# Altium schematic sheet PIC32MK.SchDoc
size B; DocumentNumber: 3; SheetNumber: 2; SheetTotal: 4
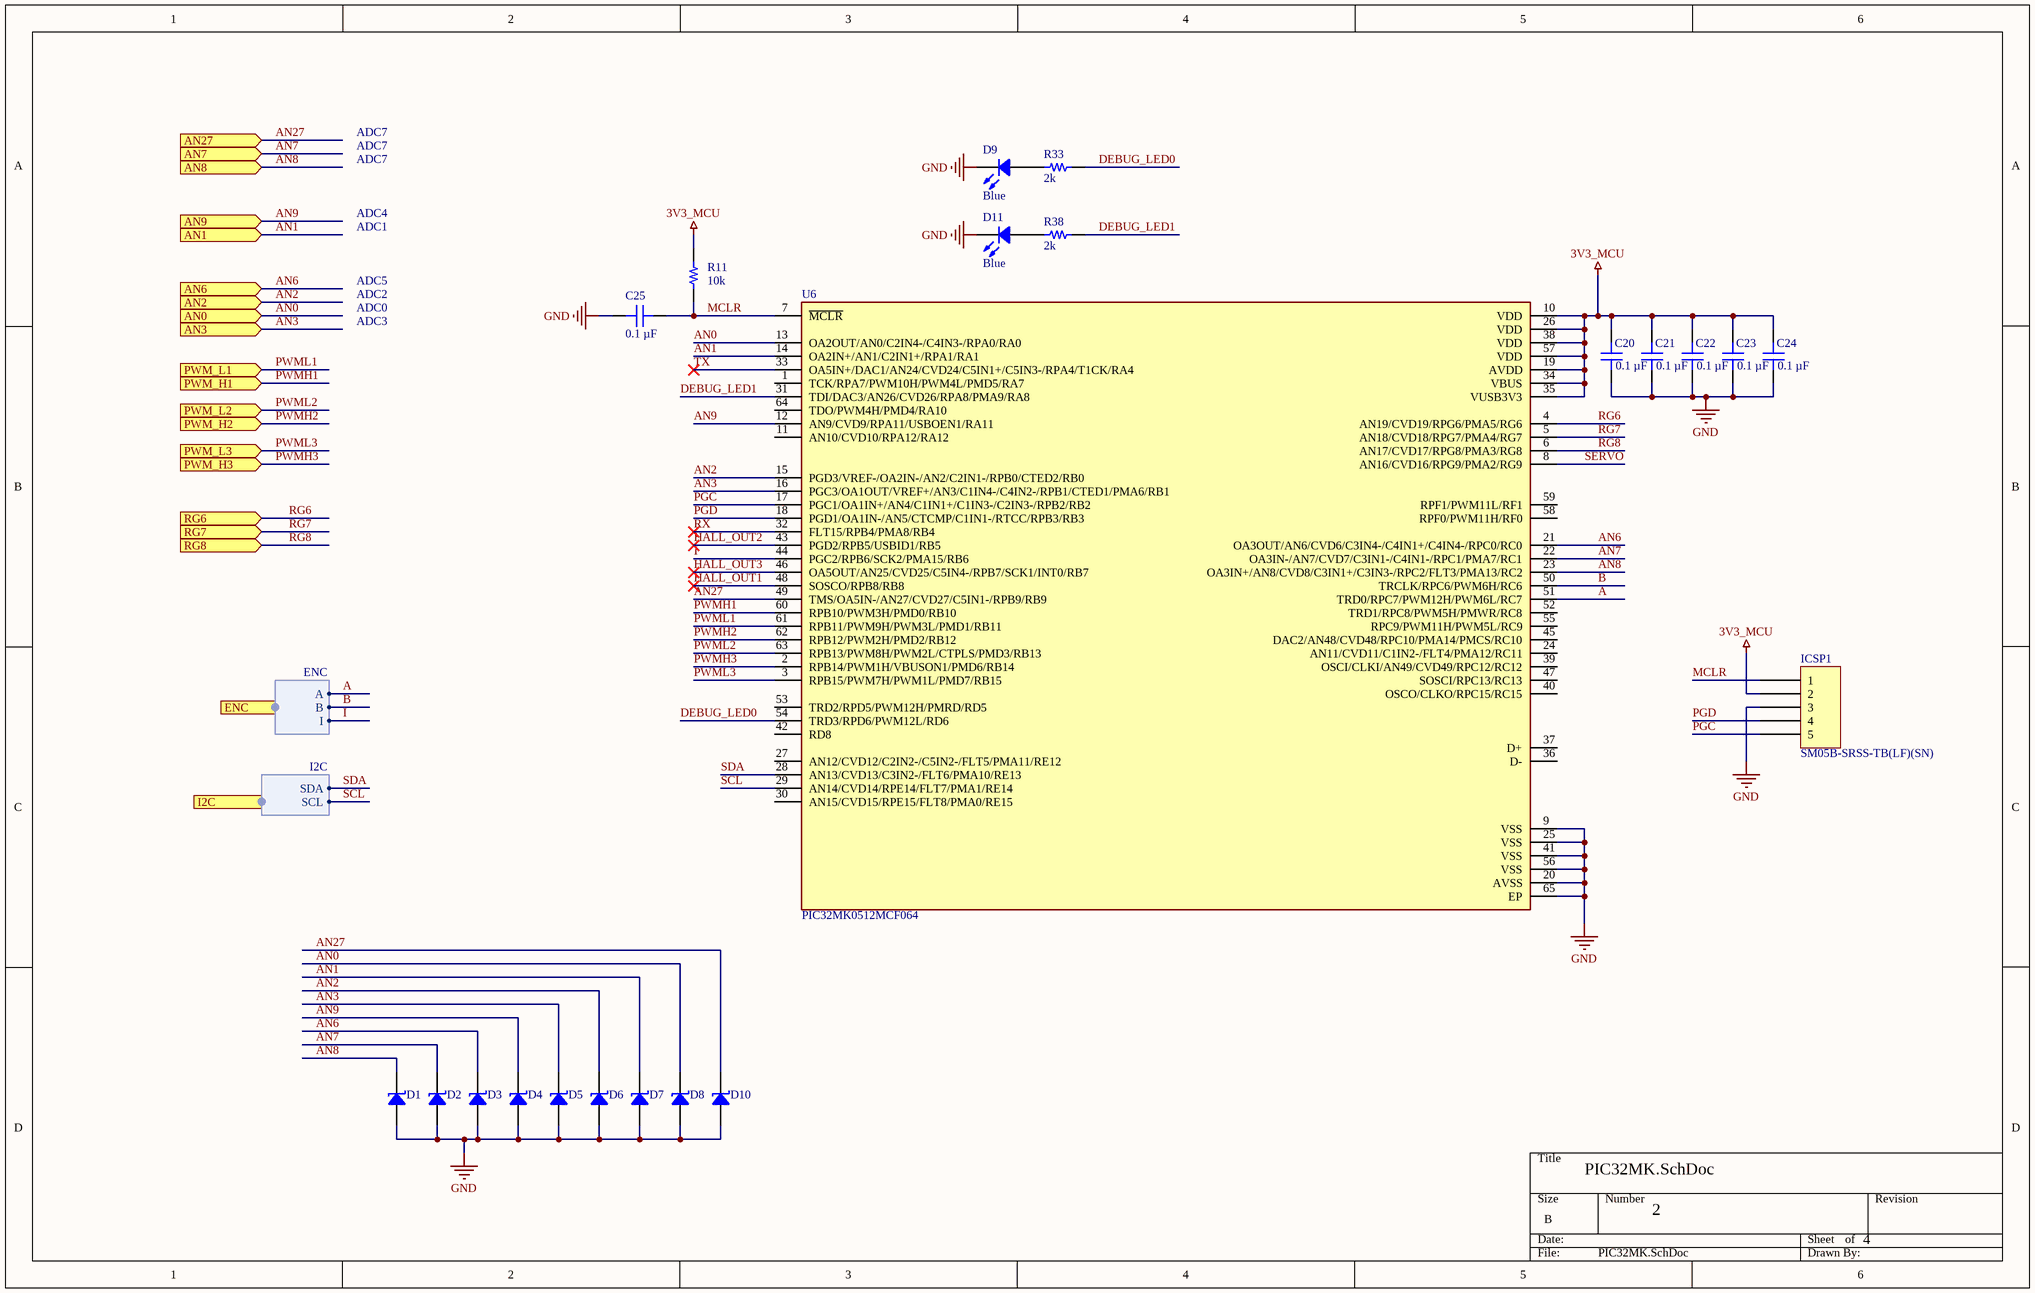
[diagram p0: PIC32MK.SchDoc]

## Parts
C20  0.1 µF  [CAP 0402_1005]
C21  0.1 µF  [CAP 0402_1005]
C22  0.1 µF  [CAP 0402_1005]
C23  0.1 µF  [CAP 0402_1005]
C24  0.1 µF  [CAP 0402_1005]
C25  0.1 µF  [CAP 0402_1005]
D1  ESDLC3V3L-TP  [0402]  (value not drawn)
D2  ESDLC3V3L-TP  [0402]  (value not drawn)
D3  ESDLC3V3L-TP  [0402]  (value not drawn)
D4  ESDLC3V3L-TP  [0402]  (value not drawn)
D5  ESDLC3V3L-TP  [0402]  (value not drawn)
D6  ESDLC3V3L-TP  [0402]  (value not drawn)
D7  ESDLC3V3L-TP  [0402]  (value not drawn)
D8  ESDLC3V3L-TP  [0402]  (value not drawn)
D9  Blue  [LED 0603_1608 GREEN]
D10  ESDLC3V3L-TP  [0402]  (value not drawn)
D11  Blue  [LED 0603_1608 GREEN]
ICSP1  SM05B-SRSS-TB(LF)(SN)  [JST SM05B-SRSS-TB]
R11  10k  [RES 0402_1005]
R33  2k  [RES 0402_1005]
R38  2k  [RES 0402_1005]
U6  PIC32MK0512MCF064  [QFN50P900X900X100-65N]

## Ports
AN0 (in), AN1 (in), AN2 (in), AN3 (in), AN6 (in), AN7 (in), AN8 (in), AN9 (in), AN27 (in), ENC (harness ENC), I2C (harness I2C), PWM_H1 (in), PWM_H2 (in), PWM_H3 (in), PWM_L1 (in), PWM_L2 (in), PWM_L3 (in), RG6 (in), RG7 (in), RG8 (in)

## Harnesses
I2C: SDA, SCL
ENC: A, B, I

## Nets
3V3_MCU: C20.2 C21.2 C22.2 C23.2 C24.2 ICSP1.2 R11.2 U6.10(VDD) U6.19(AVDD) U6.26(VDD) U6.34(VBUS) U6.35(VUSB3V3) U6.38(VDD) U6.57(VDD)
GND: C20.1 C21.1 C22.1 C23.1 C24.1 C25.2 D1.1 D2.1 D3.1 D4.1 D5.1 D6.1 D7.1 D8.1 D9.2 D10.1 D11.2 ICSP1.3 U6.9(VSS) U6.20(AVSS) U6.25(VSS) U6.41(VSS) U6.56(VSS) U6.65(EP)
A: U6.51(TRD0/RPC7/PWM12H/PWM6L/RC7) ; port ENC.A
AN0: D8.2 U6.13(OA2OUT/AN0/C2IN4-/C4IN3-/RPA0/RA0) ; port AN0
AN1: D7.2 U6.14(OA2IN+/AN1/C2IN1+/RPA1/RA1) ; port AN1
AN2: D6.2 U6.15(PGD3/VREF-/OA2IN-/AN2/C2IN1-/RPB0/CTED2/RB0) ; port AN2
AN3: D5.2 U6.16(PGC3/OA1OUT/VREF+/AN3/C1IN4-/C4IN2-/RPB1/CTED1/PMA6/RB1) ; port AN3
AN6: D3.2 U6.21(OA3OUT/AN6/CVD6/C3IN4-/C4IN1+/C4IN4-/RPC0/RC0) ; port AN6
AN7: D2.2 U6.22(OA3IN-/AN7/CVD7/C3IN1-/C4IN1-/RPC1/PMA7/RC1) ; port AN7
AN8: D1.2 U6.23(OA3IN+/AN8/CVD8/C3IN1+/C3IN3-/RPC2/FLT3/PMA13/RC2) ; port AN8
AN9: D4.2 U6.12(AN9/CVD9/RPA11/USBOEN1/RA11) ; port AN9
AN27: D10.2 U6.49(TMS/OA5IN-/AN27/CVD27/C5IN1-/RPB9/RB9) ; port AN27
B: U6.50(TRCLK/RPC6/PWM6H/RC6) ; port ENC.B
DEBUG_LED0: R33.1 U6.54(TRD3/RPD6/PWM12L/RD6)
DEBUG_LED1: R38.1 U6.31(TDI/DAC3/AN26/CVD26/RPA8/PMA9/RA8)
HALL_OUT1: U6.48(SOSCO/RPB8/RB8)
HALL_OUT2: U6.43(PGD2/RPB5/USBID1/RB5)
HALL_OUT3: U6.46(OA5OUT/AN25/CVD25/C5IN4-/RPB7/SCK1/INT0/RB7)
I: U6.44(PGC2/RPB6/SCK2/PMA15/RB6) ; port ENC.I
MCLR: C25.1 ICSP1.1 R11.1 U6.7(~{MCLR})
PGC: ICSP1.5 U6.17(PGC1/OA1IN+/AN4/C1IN1+/C1IN3-/C2IN3-/RPB2/RB2)
PGD: ICSP1.4 U6.18(PGD1/OA1IN-/AN5/CTCMP/C1IN1-/RTCC/RPB3/RB3)
PWMH1: U6.60(RPB10/PWM3H/PMD0/RB10) ; port PWM_H1
PWMH2: U6.62(RPB12/PWM2H/PMD2/RB12) ; port PWM_H2
PWMH3: U6.2(RPB14/PWM1H/VBUSON1/PMD6/RB14) ; port PWM_H3
PWML1: U6.61(RPB11/PWM9H/PWM3L/PMD1/RB11) ; port PWM_L1
PWML2: U6.63(RPB13/PWM8H/PWM2L/CTPLS/PMD3/RB13) ; port PWM_L2
PWML3: U6.3(RPB15/PWM7H/PWM1L/PMD7/RB15) ; port PWM_L3
RG6: U6.4(AN19/CVD19/RPG6/PMA5/RG6) ; port RG6
RG7: U6.5(AN18/CVD18/RPG7/PMA4/RG7) ; port RG7
RG8: U6.6(AN17/CVD17/RPG8/PMA3/RG8) ; port RG8
RX: U6.32(FLT15/RPB4/PMA8/RB4)
SCL: U6.29(AN14/CVD14/RPE14/FLT7/PMA1/RE14) ; port I2C.SCL
SDA: U6.28(AN13/CVD13/C3IN2-/FLT6/PMA10/RE13) ; port I2C.SDA
SERVO: U6.8(AN16/CVD16/RPG9/PMA2/RG9)
TX: U6.33(OA5IN+/DAC1/AN24/CVD24/C5IN1+/C5IN3-/RPA4/T1CK/RA4)
NetD9_1: D9.1 R33.2
NetD11_1: D11.1 R38.2

Not connected (* = marked no-connect by the designer): U6 1(TCK/RPA7/PWM10H/PWM4L/PMD5/RA7) 11(AN10/CVD10/RPA12/RA12) 24(AN11/CVD11/C1IN2-/FLT4/PMA12/RC11) 27(AN12/CVD12/C2IN2-/C5IN2-/FLT5/PMA11/RE12) 30(AN15/CVD15/RPE15/FLT8/PMA0/RE15) 36(D-) 37(D+) 39(OSCI/CLKI/AN49/CVD49/RPC12/RC12) 40(OSCO/CLKO/RPC15/RC15) 42(RD8) 45(DAC2/AN48/CVD48/RPC10/PMA14/PMCS/RC10) 47(SOSCI/RPC13/RC13) 52(TRD1/RPC8/PWM5H/PMWR/RC8) 53(TRD2/RPD5/PWM12H/PMRD/RD5) 55(RPC9/PWM11H/PWM5L/RC9) 58(RPF0/PWM11H/RF0) 59(RPF1/PWM11L/RF1) 64(TDO/PWM4H/PMD4/RA10)

## Notes on the sheet
- ADC7
- ADC4
- ADC1
- ADC5
- ADC2
- ADC0
- ADC3

## Library data of the parts
C20-C25 = C0402C104K4RACAUTO: CAP CER 0.1UF 16V X7R 0402; manufacturer: KEMET; Tolerance: ±10%; Part Number: C0402C104K4RACAUTO; Value: 0.1 µF; Applications: Automotive, Bypass, Decoupling; Capacitance: 0.1 µF; componentlink1description: Datasheet; componentlink1url: https://api.kemet.com/component-edge/download/specsheet/C0402C104K4RACAUTO.pdf; componentlink2description: DigiKey Link; componentlink2url: https://www.digikey.com/en/products/detail/kemet/C0402C104K4RACAUTO/3314827; Device Package: 0402 (1005 Metric); lastupdated: 8/14/2022 9:05:51 PM; Lifecycle Status: Active; Minimum Order: 1; Mounting Type: Surface Mount, MLCC; Operating Temperature: -55°C ~ 125°C; Package / Case: 0402 (1005 Metric); packaging: TapeAndReel; partid: 3024; Part Status: Active; price: 0.01; Ratings: AEC-Q200; series: SMD Auto X7R; Size / Dimension: 0.039" L x 0.020" W (1.00mm x 0.50mm); Supplier 1: DigiKey; Supplier Part Number 1: 399-6828-1-ND; Temperature Coefficient: X7R; Thickness (Max): 0.022" (0.55mm); Voltage - Rated: 16V
D1-D8 D10 = ESDLC3V3L-TP: TVS DIODE 3.3V 15V DFN1006-2; Manufacturer: Micro Commercial Co; Capacitance @ Frequency: 22pF @ 1MHz; Current - Peak Pulse (10/1000µs): 10A (8/20µs); Power Line Protection: No; Power - Peak Pulse: 150W; Type: Zener; Unidirectional Channels: 1; Voltage - Reverse Standoff (Typ): 3.3V (Max); Part Number: ESDLC3V3L-TP; Applications: General Purpose; ComponentLink1Description: Datasheet; ComponentLink1URL: https://www.mccsemi.com/pdf/Products/ESDLC3V3L(DFN1006-2)-A.pdf; ComponentLink2Description: DigiKey Link; ComponentLink2URL: http://digikey.com/product-detail/en/micro-commercial-co/ESDLC3V3L-TP/ESDLC3V3L-TPMSCT-ND/7681669; Device Package: 0402 (1006 Metric); LastUpdated: 6/3/2024 8:22:51 PM; Lifecycle Status: Active; Minimum Order: 1; Mounting Type: Surface Mount; Operating Temperature: -55°C ~ 125°C (TJ); Package / Case: 0402 (1006 Metric); Packaging: TapeAndReel; PartId: 10373; Part Status: Active; Price: 0.03; Series: -; Supplier 1: DigiKey; Supplier Part Number 1: ESDLC3V3L-TPMSCT-ND; Supplier Device Package: DFN1006-2; Voltage - Clamping (Max) @ Ipp: 15V
D9 D11 = XZCDGK53W-8VF: Blue LED; Manufacturer: SunLED; Color: Green; Configuration: Independent; Current - Test: 2mA; Lens Color: Colorless; Lens Size: 0.35mm Dia; Lens Style: Round with Domed Top; Lens Transparency: Clear; Millicandela Rating: 417mcd; Value: Green; Viewing Angle: 60°; Voltage - Forward (Vf) (Typ): 2.65V; Wavelength - Dominant: 525nm; Wavelength - Peak: 515nm; Part Number: XZCDGK53W-8VF; ComponentLink1Description: Datasheet; ComponentLink1URL: https://www.sunledusa.com/products/spec/XZCDGK53W-8VF.pdf; ComponentLink2Description: DigiKey Link; ComponentLink2URL: http://digikey.com/product-detail/en/sunled/XZCDGK53W-8VF/1497-XZCDGK53W-8VFCT-ND/10449792; Device Package: 0603 (1608 Metric); Height (Max): 1.10mm; LastUpdated: 21-Jan-20 3:12:09 AM; Lifecycle Status: Active; Minimum Order: 1; Mounting Type: Surface Mount; Package / Case: 0603 (1608 Metric); Packaging: Unknown; PartId: 938; Part Status: Active; Price: 0.18; Series: Ultra Low Current; Size / Dimension: 1.60mm L x 0.80mm W; Supplier 1: DigiKey; Supplier Part Number 1: 1497-XZCDGK53W-8VFCT-ND; Supplier Device Package: 2-SMD
ICSP1 = SM05B-SRSS-TB(LF)(SN): CONN HEADER SMD R/A 5POS 1MM; Manufacturer: JST Sales America Inc.; Current Rating (Amps): 0.7A; Material Flammability Rating: UL94 V-0; Number of Positions: 5; Number of Positions Loaded: All; Pitch - Mating: 0.039" (1.00mm); Shrouding: Shrouded - 4 Wall; Style: Board to Cable/Wire; Voltage Rating: 50V; Part Number: SM05B-SRSS-TB(LF)(SN); ComponentLink1Description: Datasheet; ComponentLink1URL: http://www.jst-mfg.com/product/pdf/eng/eSH.pdf; ComponentLink2Description: DigiKey Link; ComponentLink2URL: http://digikey.com/product-detail/en/jst-sales-america-inc/SM05B-SRSS-TB-LF-SN/455-1805-1-ND/926876; Connector Type: Header; Contact Finish - Mating: Tin; Contact Finish - Post: Tin; Contact Material: Copper Alloy; Contact Shape: Square; Contact Type: Male Pin; Fastening Type: Push-Pull; Features: Solder Retention; Insulation Color: Natural; Insulation Height: 0.114" (2.90mm); Insulation Material: Polyamide (PA), Nylon; LastUpdated: 1/12/2020 11:42:04 PM; Lifecycle Status: Active; Minimum Order: 1; Mounting Type: Surface Mount, Right Angle; Number of Rows: 1; Operating Temperature: -25°C ~ 85°C; Packaging: TapeAndReel; PartId: 63; Part Status: Active; Price: 0.32; Series: SR; Supplier 1: DigiKey; Supplier Part Number 1: 455-1805-1-ND; Termination: Solder
R11 R33 R38 = RK73H1ETTP1432F: RES 14.3K OHM 1% 1/10W 0402; Manufacturer: KOA Speer Electronics, Inc.; Power (Watts): 0.1W, 1/10W; Resistance: 14.3 kOhms; Temperature Coefficient: ±100ppm/°C; Part Number: RK73H1ETTP1432F; ComponentLink1Description: Datasheet; ComponentLink1URL: http://www.koaspeer.com/catimages/Products/RK73H/RK73H.pdf; ComponentLink2Description: DigiKey Link; ComponentLink2URL: https://www.digikey.com/en/products/detail/koa-speer-electronics-inc/RK73H1ETTP1432F/9844351; Composition: Thick Film; Device Package: 0402 (1005 Metric); Features: Automotive AEC-Q200, Moisture Resistant; Height - Seated (Max): 0.016" (0.40mm); LastUpdated: 8/14/2022 9:23:49 PM; Lifecycle Status: Active; Minimum Order: 1; Number of Terminations: 2; Operating Temperature: -55°C ~ 155°C; Package / Case: 0402 (1005 Metric); Packaging: CutTape; PartId: 10193; Part Status: Active; Price: 0.01; Ratings: AEC-Q200; Series: RK73H; Size / Dimension: 0.039" L x 0.020" W (1.00mm x 0.50mm); Supplier 1: DigiKey; Supplier Part Number 1: 2019-RK73H1ETTP1432FCT-ND; Supplier Device Package: 0402; Tolerance: ±1%
  R11: Value: 10k
  R33 R38: Value: 2k
U6 = PIC32MK0512MCF064: PIC32MK Microcontroller IC 32-Bit 120MHz 1MB _1M x 8_ FLASH 64-TQFP _10x10_; MP: PIC32MK1024MCF064-I/PT; MF: Microchip; Digi-Key_Purchase_URL: https://www.digikey.kr/product-detail/en/microchip-technology/PIC32MK1024MCF064-I-PT/PIC32MK1024MCF064-I-PT-ND/7164902?utm_source=snapeda&utm_medium=aggregator&utm_campaign=symbol; Package: TQFP-64 Microchip; Digi-Key_Part_Number: PIC32MK1024MCF064-I/PT-ND; Value: *; SnapEDA_Link: https://www.snapeda.com/parts/PIC32MK1024MCF064-I/PT/Microchip/view-part/876704/?ref=snap